# Altium schematic sheet left_panel.SchDoc
size A4
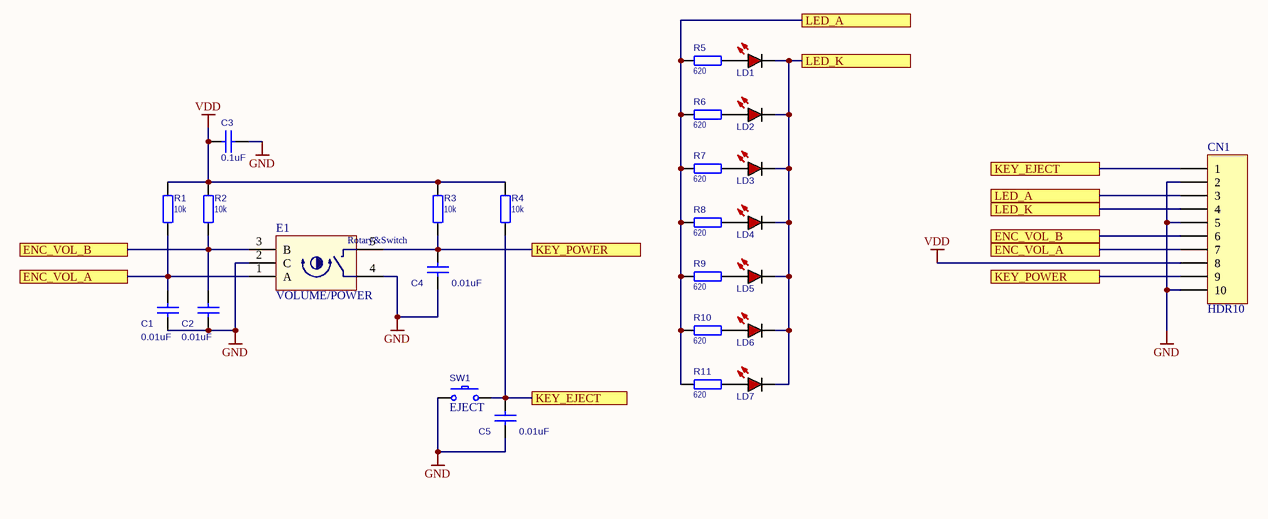
[diagram p0: left_panel.SchDoc]

## Parts
C1  value 0.01uF  [C0603]  (hidden comment: CL10B103KB8NNNC)
C2  value 0.01uF  [C0603]  (hidden comment: CL10B103KB8NNNC)
C3  value 0.1uF  [C0603]  (hidden comment: CC0603KRX7R9BB104)
C4  value 0.01uF  [C0603]  (hidden comment: CL10B103KB8NNNC)
C5  value 0.01uF  [C0603]  (hidden comment: CL10B103KB8NNNC)
CN1  HDR10  [10S-0.5SH]
E1  VOLUME/POWER  [Rotary Encoder]
LD1  LED_R  [LED0805]  (value not drawn)
LD2  LED_R  [LED0805]  (value not drawn)
LD3  LED_R  [LED0805]  (value not drawn)
LD4  LED_R  [LED0805]  (value not drawn)
LD5  LED_R  [LED0805]  (value not drawn)
LD6  LED_R  [LED0805]  (value not drawn)
LD7  LED_R  [LED0805]  (value not drawn)
R1  10k  [R0603]
R2  10k  [R0603]
R3  10k  [R0603]
R4  10k  [R0603]
R5  620  [R0603]
R6  620  [R0603]
R7  620  [R0603]
R8  620  [R0603]
R9  620  [R0603]
R10  620  [R0603]
R11  620  [R0603]
SW1  EJECT  [6X6-SMT-2PIN]

## Ports
ENC_VOL_A, ENC_VOL_B, KEY_EJECT, KEY_POWER, LED_A, LED_K

## Nets
GND: C1.1 C2.1 C3.2 C4.1 C5.1 CN1.2 CN1.5 CN1.10 E1.2(C) E1.4(SW) SW1.1
VDD: C3.1 CN1.8 R1.2 R2.1 R3.2 R4.2
ENC_VOL_A: C1.2 CN1.7 E1.1(A) R1.1 ; port ENC_VOL_A
ENC_VOL_B: C2.2 CN1.6 E1.3(B) R2.2 ; port ENC_VOL_B
KEY_EJECT: C5.2 CN1.1 R4.1 SW1.2 ; port KEY_EJECT
KEY_POWER: C4.2 CN1.9 E1.5(SW) R3.1 ; port KEY_POWER
LED_A: CN1.3 R5.1 R6.1 R7.1 R8.1 R9.1 R10.1 R11.1 ; port LED_A
LED_K: CN1.4 LD1.1 LD2.1 LD3.1 LD4.1 LD5.1 LD6.1 LD7.1 ; port LED_K
NetLD1_2: LD1.2 R5.2
NetLD2_2: LD2.2 R6.2
NetLD3_2: LD3.2 R7.2
NetLD4_2: LD4.2 R8.2
NetLD5_2: LD5.2 R9.2
NetLD6_2: LD6.2 R10.2
NetLD7_2: LD7.2 R11.2

## Notes on the sheet
- (in symbol ENC_SW) Rotary&Switch

## Library data of the parts
C1-C5 = CAP_NPOL
CN1 = HDR 10: Header, 10-Pin; LatestRevisionDate: 17-Jul-2002; LatestRevisionNote: Re-released for DXP Platform.; Publisher: Altium Limited
E1 = ENC_SW
LD1-LD7 = LED_RED: LED Red; Value: *
R1-R11 = RESISTOR: RES
  R1-R4: Value: 10k
  R5-R11: Value: 620
SW1 = SW tact 2-pin: Microswitches, DTSMB-3 series; Value: SW tact 2-pin